# Altium project PCB_Project.PrjPcb
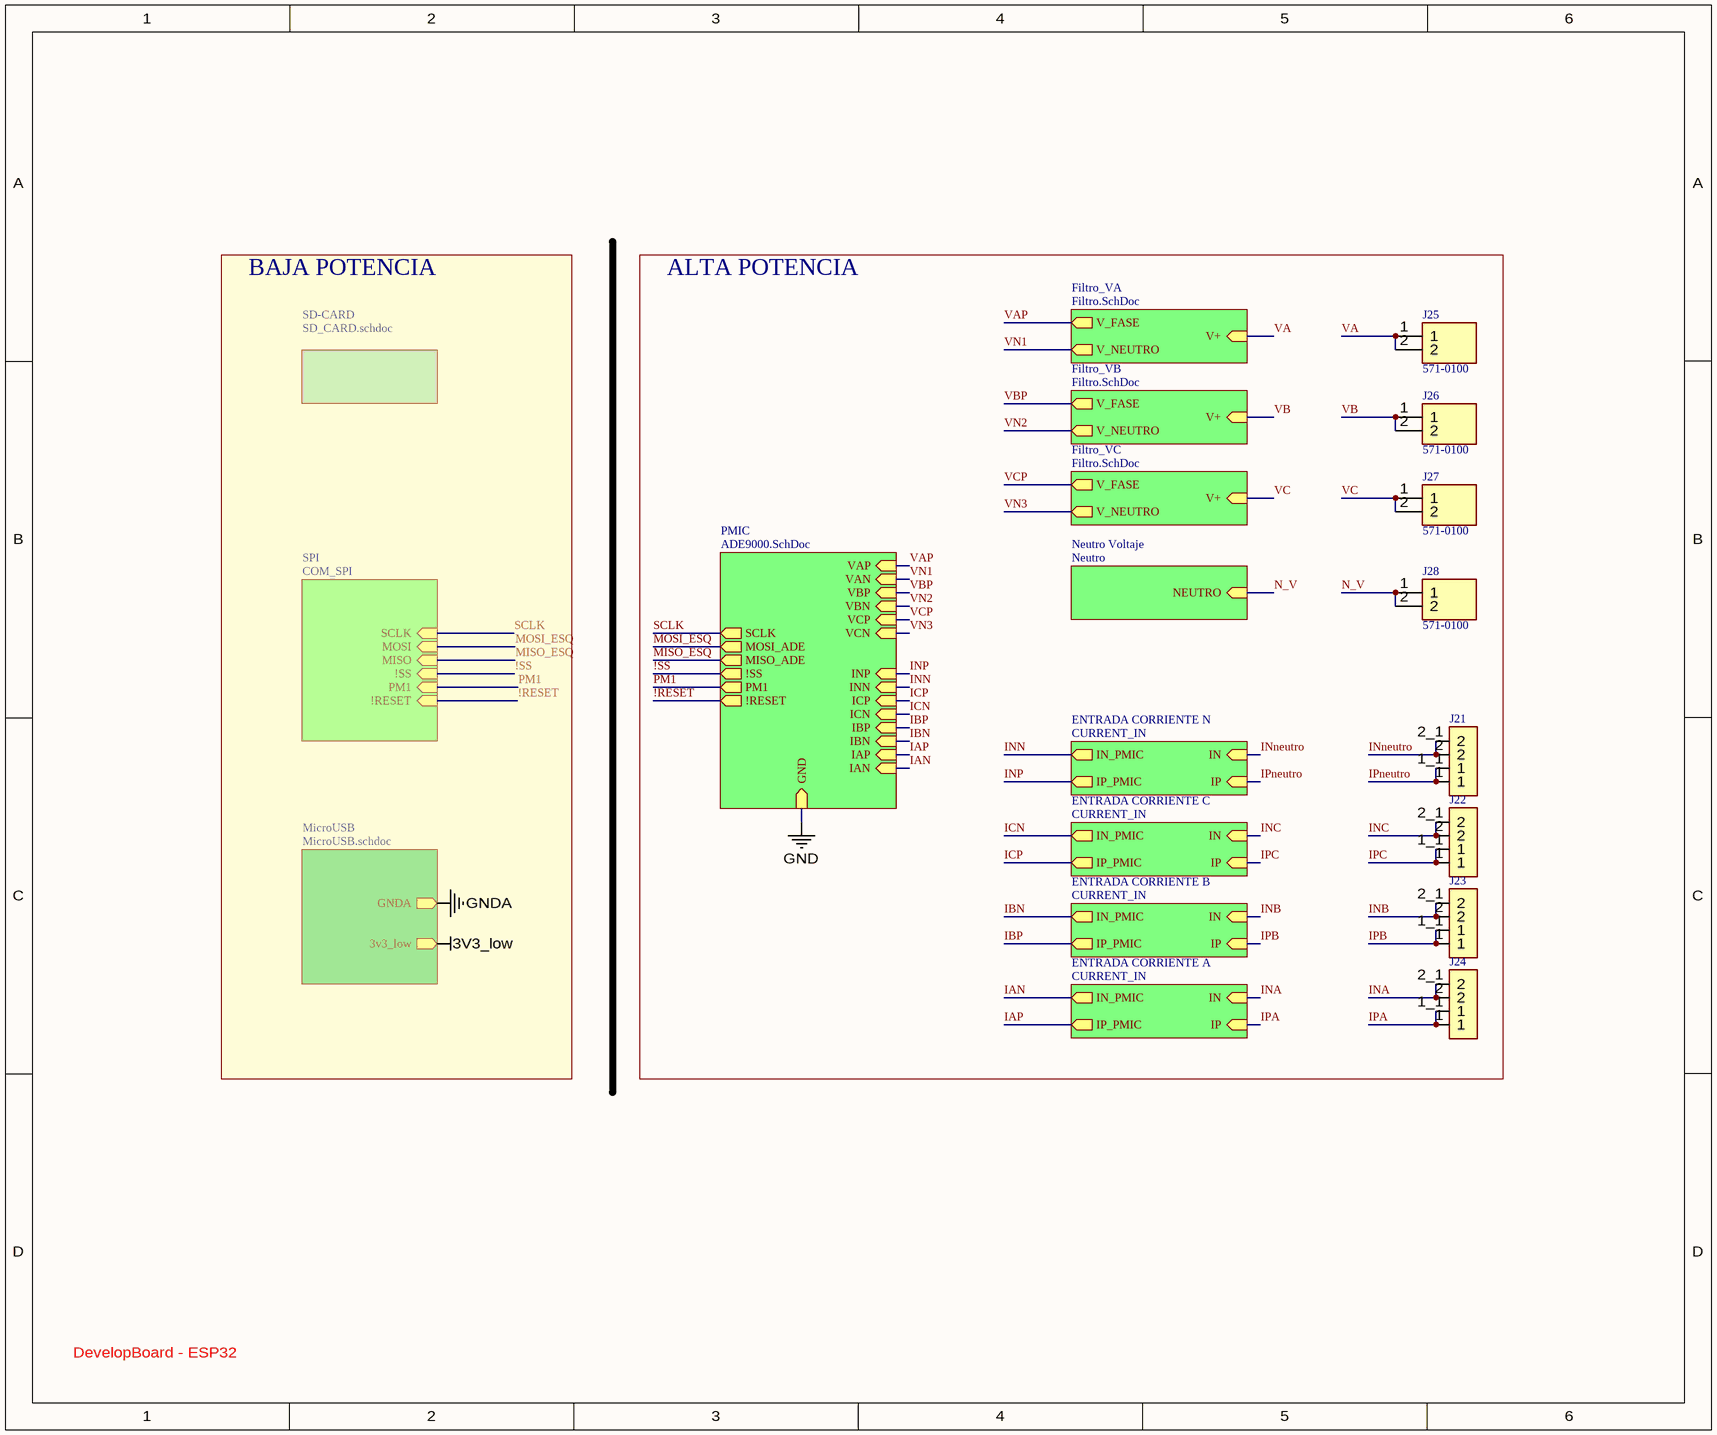
[diagram p0: Esquematico1.schdoc]
7 sheets, 124 parts. Net scope: hierarchical (ports join the sheet entries above them; power ports are global).
Board file: Esquematico.PcbDoc
Sheets:
  Esquematico1.schdoc
    MicroUSB = MicroUSB.SchDoc
    Filtro_VA = Filtro.SchDoc
    Filtro_VB = Filtro.SchDoc
    Filtro_VC = Filtro.SchDoc
    PMIC = ADE9000.SchDoc
    SPI = COM_SPI.SchDoc
    ENTRADA CORRIENTE N = CURRENT_IN.SchDoc
    ENTRADA CORRIENTE C = CURRENT_IN.SchDoc
    ENTRADA CORRIENTE B = CURRENT_IN.SchDoc
    ENTRADA CORRIENTE A = CURRENT_IN.SchDoc
    Neutro Voltaje = Neutro.SchDoc

## Sheet Esquematico1.schdoc
size 321 x 267 mm

### Parts
J21  2834082-1  [TE_2834082-1]  (value not drawn)
J22  2834082-1  [TE_2834082-1]  (value not drawn)
J23  2834082-1  [TE_2834082-1]  (value not drawn)
J24  2834082-1  [TE_2834082-1]  (value not drawn)
J25  571-0100  [5710100]
J26  571-0100  [5710100]
J27  571-0100  [5710100]
J28  571-0100  [5710100]

### Blocks framed on the sheet
ALTA POTENCIA: J21-J28

### Sub-sheets
ENTRADA CORRIENTE A = CURRENT_IN: IN (in), IP_PMIC (out), IP (in), IN_PMIC (out)
ENTRADA CORRIENTE B = CURRENT_IN: IN (in), IP_PMIC (out), IP (in), IN_PMIC (out)
ENTRADA CORRIENTE C = CURRENT_IN: IN (in), IP_PMIC (out), IP (in), IN_PMIC (out)
ENTRADA CORRIENTE N = CURRENT_IN: IN (in), IP_PMIC (out), IP (in), IN_PMIC (out)
Filtro_VA = Filtro.SchDoc: V+ (in), V_NEUTRO (out), V_FASE (out)
Filtro_VB = Filtro.SchDoc: V+ (in), V_NEUTRO (out), V_FASE (out)
Filtro_VC = Filtro.SchDoc: V+ (in), V_NEUTRO (out), V_FASE (out)
MicroUSB = MicroUSB.schdoc: GNDA (out), 3v3_low (out)
Neutro Voltaje = Neutro: NEUTRO (in)
PMIC = ADE9000.SchDoc: SCLK (out), PM1 (out), IBP (in), IBN (in), IAP (in), ICP (in), ICN (in), INP (in), INN (in), VAN (in), VAP (in), VBN (in), VBP (in), VCP (in), VCN (in), !RESET (out), !SS (out), IAN (in), GND (in), MISO_ADE (out), MOSI_ADE (out)
SD-CARD = SD_CARD.schdoc (file not in this document): no entries
SPI = COM_SPI: !RESET (in), PM1 (in), !SS (in), MISO (in), MOSI (in), SCLK (in)

### Nets
!RESET: sheet PMIC/!RESET, sheet SPI/!RESET
!SS: sheet PMIC/!SS, sheet SPI/!SS
IAN: sheet PMIC/IAN, sheet ENTRADA CORRIENTE A/IN_PMIC
IAP: sheet PMIC/IAP, sheet ENTRADA CORRIENTE A/IP_PMIC
IBN: sheet PMIC/IBN, sheet ENTRADA CORRIENTE B/IN_PMIC
IBP: sheet PMIC/IBP, sheet ENTRADA CORRIENTE B/IP_PMIC
ICN: sheet PMIC/ICN, sheet ENTRADA CORRIENTE C/IN_PMIC
ICP: sheet PMIC/ICP, sheet ENTRADA CORRIENTE C/IP_PMIC
INA: J24.2 J24.2_1(2) ; sheet ENTRADA CORRIENTE A/IN
INB: J23.2 J23.2_1(2) ; sheet ENTRADA CORRIENTE B/IN
INC: J22.2 J22.2_1(2) ; sheet ENTRADA CORRIENTE C/IN
INN: sheet PMIC/INN, sheet ENTRADA CORRIENTE N/IN_PMIC
INneutro: J21.2 J21.2_1(2) ; sheet ENTRADA CORRIENTE N/IN
INP: sheet PMIC/INP, sheet ENTRADA CORRIENTE N/IP_PMIC
IPA: J24.1 J24.1_1(1) ; sheet ENTRADA CORRIENTE A/IP
IPB: J23.1 J23.1_1(1) ; sheet ENTRADA CORRIENTE B/IP
IPC: J22.1 J22.1_1(1) ; sheet ENTRADA CORRIENTE C/IP
IPneutro: J21.1 J21.1_1(1) ; sheet ENTRADA CORRIENTE N/IP
MISO_ESQ: sheet PMIC/MISO_ADE, sheet SPI/MISO  [project net MISO_ADE9000]
MOSI_ESQ: sheet PMIC/MOSI_ADE, sheet SPI/MOSI  [project net MOSI_ADE9000]
N_V: J28.1 J28.2 ; sheet Neutro Voltaje/NEUTRO
PM1: sheet PMIC/PM1, sheet SPI/PM1
SCLK: sheet PMIC/SCLK, sheet SPI/SCLK
VA: J25.1 J25.2 ; sheet Filtro_VA/V+
VAP: sheet Filtro_VA/V_FASE, sheet PMIC/VAP
VB: J26.1 J26.2 ; sheet Filtro_VB/V+
VBP: sheet Filtro_VB/V_FASE, sheet PMIC/VBP
VC: J27.1 J27.2 ; sheet Filtro_VC/V+
VCP: sheet Filtro_VC/V_FASE, sheet PMIC/VCP
VN1: sheet Filtro_VA/V_NEUTRO, sheet PMIC/VAN
VN2: sheet Filtro_VB/V_NEUTRO, sheet PMIC/VBN
VN3: sheet Filtro_VC/V_NEUTRO, sheet PMIC/VCN

### Notes on the sheet
- BAJA POTENCIA
- DevelopBoard - ESP32

### Library data of the parts
J21-J24 = 2834082-1: Conn PC Terminal Block 2 POS 5mm Solder ST Thru-Hole 20A/Contact Box/Carton; MF: TE Connectivity; TE_purchase_URL: https://www.te.com/usa-en/product-2834082-1.html?te_bu=Cor&te_type=disp&te_campaign=seda_glo_cor-seda-global-disp-prtnr-fy19-seda-model-bom-cta_sma-317_1&elqCampaignId=32493; Digi-Key_Part_Number: A124223-ND; Package: None; SnapEDA_Link: https://www.snapeda.com/parts/2834082-1/TE%20Connectivity%20AMP%20Connectors/view-part/2471183/?ref=snap; MP: 2834082-1; Value: *; Digi-Key_Purchase_URL: https://www.digikey.com/product-detail/en/te-connectivity-amp-connectors/2834082-1/A124223-ND/6012670?utm_source=snapeda&utm_medium=aggregator&utm_campaign=symbol; Comment_1: *
J25-J28 = 571-0100: Connector; Manufacturer_Name: Deltron; Datasheet Link: https://www.dem-uk.com/deltron-components/Data/Product_Downloads/deltron-571-0100-4mm-90deg-single-socket-data.pdf; Height: 12.4mm; Manufacturer_Part_Number: 571-0100; Mouser Part Number: 164-6218; Mouser Price/Stock: https://www.mouser.co.uk/ProductDetail/Deltron/571-0100?qs=E2gf03EXmtoqC8%2FBhoPdrg%3D%3D

## Sheet MicroUSB.SchDoc
size A4
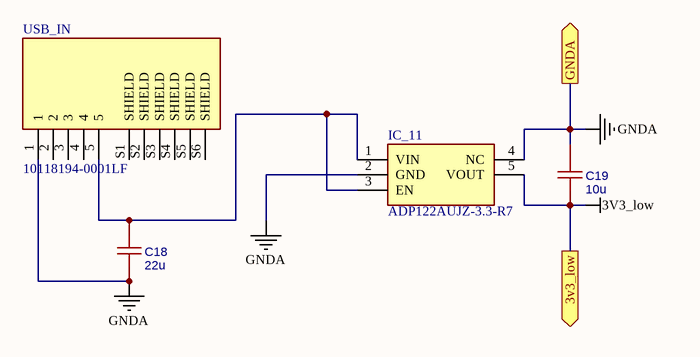
[diagram p1: MicroUSB.SchDoc]

### Parts
C18  22u  [CAPC3216X190]
C19  10u  [CAPC3216X190]
IC_11  ADP122AUJZ-3.3-R7  [SOT95P280X100-5N]
USB_IN  10118194-0001LF  [AMPHENOL_10118194-0001LF]

### Ports
3v3_low (out), GNDA (out)

### Nets
3V3_low: C19.1 IC_11.5(VOUT) ; port 3v3_low
GNDA: C18.1 C19.2 IC_11.2(GND) IC_11.4(NC) USB_IN.1 ; port GNDA
NetC18_2: C18.2 IC_11.1(VIN) IC_11.3(EN) USB_IN.5

Not connected (* = marked no-connect by the designer): USB_IN 2 3 4 S1(SHIELD) S2(SHIELD) S3(SHIELD) S4(SHIELD) S5(SHIELD) S6(SHIELD)

### Library data of the parts
C18 C19 = 100nF: nameAlias: Value(F); spicePre: C; spiceSymbolName: Cap_RAD-0.1_US
IC_11 = ADP122AUJZ-3.3-R7: Integrated Circuit; Manufacturer_Name: Analog Devices; Datasheet Link: http://uk.rs-online.com/web/p/products/9128071; Height: 1mm; Manufacturer_Part_Number: ADP122AUJZ-3.3-R7; Arrow Part Number: ADP122AUJZ-3.3-R7; Arrow Price/Stock: https://www.arrow.com/en/products/adp122aujz-3.3-r7/analog-devices; Mouser Part Number: 584-ADP122AUJZ-3.3R7; Mouser Price/Stock: https://www.mouser.co.uk/ProductDetail/Analog-Devices/ADP122AUJZ-33-R7?qs=BpaRKvA4VqERsawSFjb%252Blw%3D%3D
USB_IN = 10118194-0001LF: USB - micro B USB 2.0 Receptacle Connector 5 Position Surface Mount, Right Angle; Through Hole; MF: Amphenol ICC; Package: None; Price: None; Availability: Unavailable; MP: 10118194-0001LF; SnapEDA_Link: https://www.snapeda.com/parts/10118194-0001LF/Amphenol%20FCI/view-part/1413308/?ref=snap; Value: *

## Sheet Filtro.SchDoc
size A4
Used 3 times, as channels Filtro_VA, Filtro_VB, Filtro_VC. Parts and nets are listed once, with the designators drawn on the sheet.
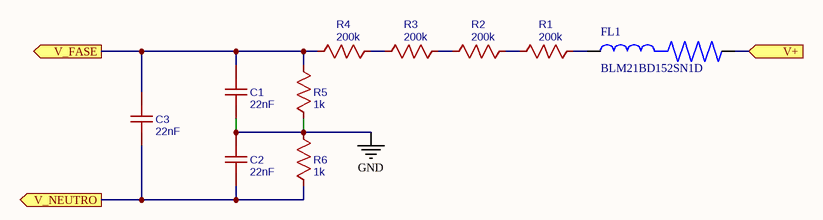
[diagram p2: Filtro.SchDoc]

### Parts
C1  22nF  [CAPC3216X190]
C2  22nF  [CAPC3216X190]
C3  22nF  [CAPC3216X190]
FL1  BLM21BD152SN1D  [BEADC2012X105N]
R1  200k  [RESC3216X75N]
R2  200k  [RESC3216X75N]
R3  200k  [RESC3216X75N]
R4  200k  [RESC3216X75N]
R5  1k  [RESC3216X75N]
R6  1k  [RESC3216X75N]

### Ports
V+ (in), V_FASE (out), V_NEUTRO (out)

### Nets
GND: C1.1 C2.2 R5.1 R6.2
V+: FL1.2 ; port V+
V_FASE: C1.2 C3.2 R4.1 R5.2 ; port V_FASE
V_NEUTRO: C2.1 C3.1 R6.1 ; port V_NEUTRO
NetFL1_1: FL1.1 R1.2
NetR1_1: R1.1 R2.2
NetR2_1: R2.1 R3.2
NetR3_1: R3.1 R4.2

### Channels
Filtro_VA: designators C1=C7 C2=C8 C3=C9 FL1=FL3 R1=R13 R2=R14 R3=R15 R4=R16 R5=R17 R6=R18; ports V+=VA V_FASE=VAP V_NEUTRO=VN1
Filtro_VB: designators C1=C4 C2=C5 C3=C6 FL1=FL2 R1=R7 R2=R8 R3=R9 R4=R10 R5=R11 R6=R12; ports V+=VB V_FASE=VBP V_NEUTRO=VN2
Filtro_VC: ports V+=VC V_FASE=VCP V_NEUTRO=VN3

### Library data of the parts
C1-C3 = 22nF: nameAlias: Value(F); spicePre: C; spiceSymbolName: Cap_RAD-0.1_US
FL1 = BLM21BD152SN1D: 1.5 kOhms @ 100MHz 1 Signal Line Ferrite Bead 0805 (2012 Metric) 250mA 450mOhm; MF: Murata; Availability: Good; Check_prices: https://www.snapeda.com/parts/BLM21BD152SN1D/Murata/view-part/290529/?ref=eda; Value: *; Package: 2012 Murata; MP: BLM21BD152SN1D; Price: None; SnapEDA_Link: https://www.snapeda.com/parts/BLM21BD152SN1D/Murata/view-part/290529/?ref=snap; Purchase-URL: https://pricing.snapeda.com/search/part/BLM21BD152SN1D/?ref=eda
R1-R4 = 330k: nameAlias: Value(Ω); spicePre: R; spiceSymbolName: Res_AXIAL-0.3(1/8W)_US
R5 R6 = 1k: nameAlias: Value(Ω); spicePre: R; spiceSymbolName: Res_AXIAL-0.3(1/8W)_US

## Sheet ADE9000.SchDoc
size A4
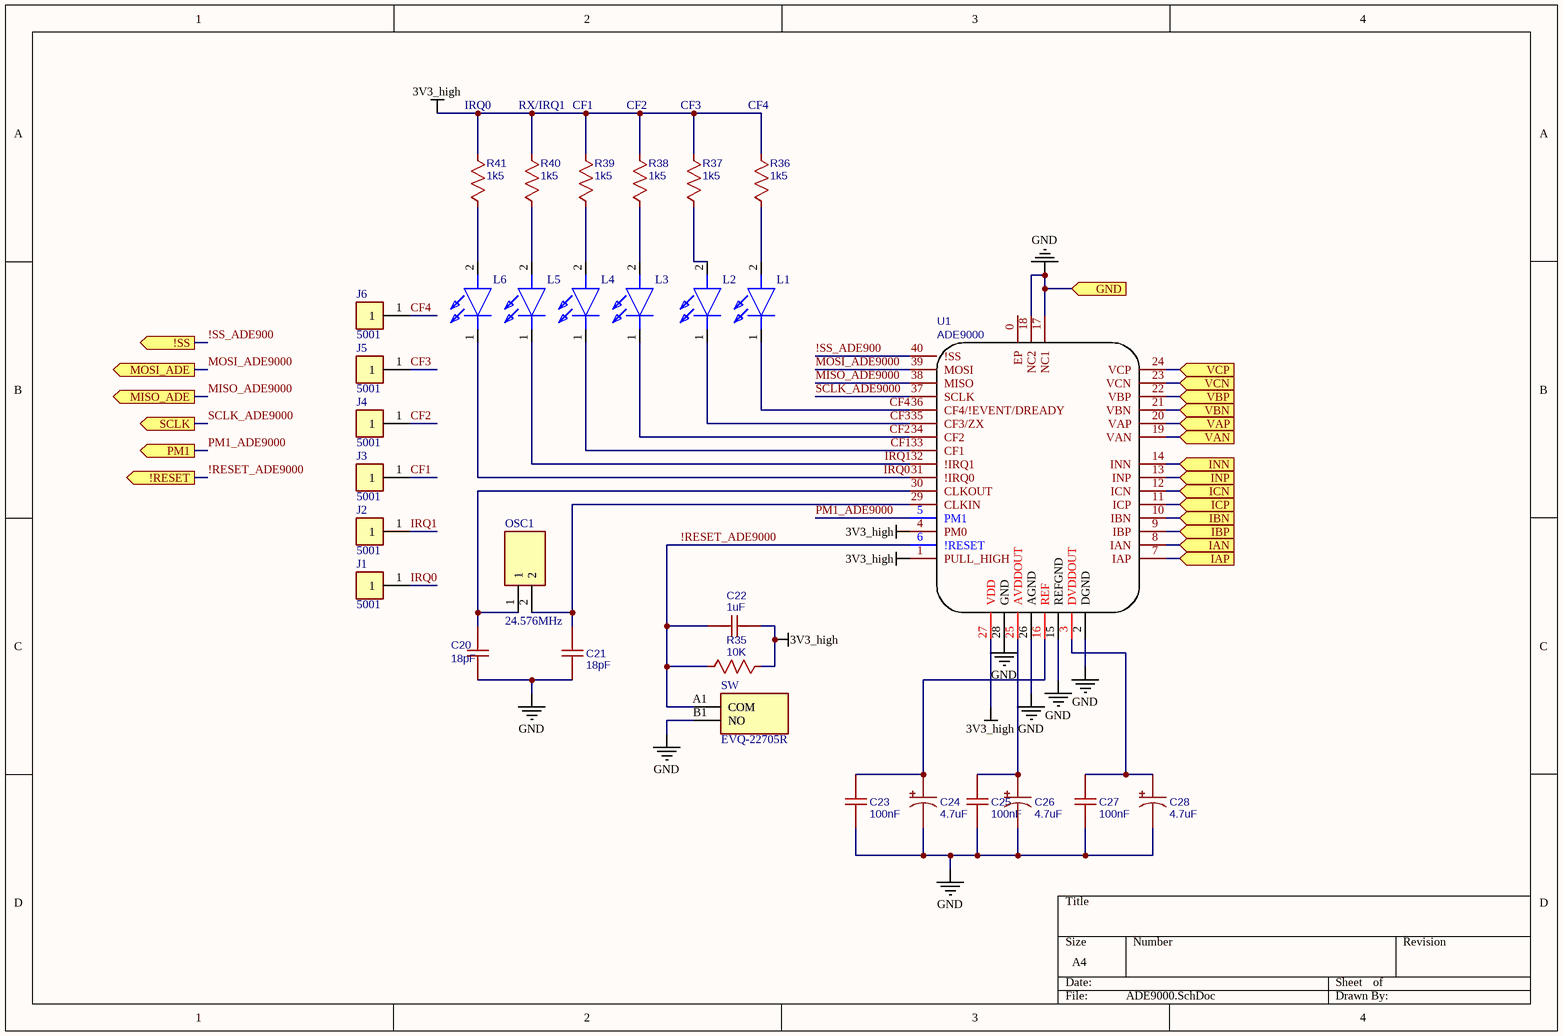
[diagram p3: ADE9000.SchDoc]

### Parts
C20  18pF  [CAPC3216X190]
C21  18pF  [CAPC3216X190]
C22  1uF  [CAPC3216X190]
C23  100nF  [CAPC3216X190]
C24  4.7uF  [CAPC3216X190]
C25  100nF  [CAPC3216X190]
C26  4.7uF  [CAPC3216X190]
C27  100nF  [CAPC3216X190]
C28  4.7uF  [CAPC3216X190]
J1  5001  [KEYSTONE_5001]
J2  5001  [KEYSTONE_5001]
J3  5001  [KEYSTONE_5001]
J4  5001  [KEYSTONE_5001]
J5  5001  [KEYSTONE_5001]
J6  5001  [KEYSTONE_5001]
L1  APT1608LZGCK  [LEDC1608X85N]  (value not drawn)
L2  APT1608LZGCK  [LEDC1608X85N]  (value not drawn)
L3  APT1608LZGCK  [LEDC1608X85N]  (value not drawn)
L4  APT1608LZGCK  [LEDC1608X85N]  (value not drawn)
L5  APT1608LZGCK  [LEDC1608X85N]  (value not drawn)
L6  APT1608LZGCK  [LEDC1608X85N]  (value not drawn)
OSC1  24.576MHz  [HC-49S_1]
R35  10K  [RESC3216X75N]
R36  1k5  [RESC3216X75N]
R37  1k5  [RESC3216X75N]
R38  1k5  [RESC3216X75N]
R39  1k5  [RESC3216X75N]
R40  1k5  [RESC3216X75N]
R41  1k5  [RESC3216X75N]
SW  EVQ-22705R  [EVQ22705R]
U1  ADE9000  [QFN50P600X600X80-41N]

### Ports
!RESET (out), !SS (out), GND (in), IAN (in), IAP (in), IBN (in), IBP (in), ICN (in), ICP (in), INN (in), INP (in), MISO_ADE (out), MOSI_ADE (out), PM1 (out), SCLK (out), VAN (in), VAP (in), VBN (in), VBP (in), VCN (in), VCP (in)

### Nets
3V3_high: C22.1 R35.2 R36.2 R37.2 R38.2 R39.2 R40.2 R41.2 U1.1(PULL_HIGH) U1.4(PM0) U1.27(VDD)
GND: C20.1 C21.1 C23.1 C24.2 C25.1 C26.2 C27.1 C28.2 SW.B1(NO) U1.2(DGND) U1.15(REFGND) U1.17(NC1) U1.18(NC2) U1.26(AGND) U1.28(GND) ; port GND
!RESET_ADE9000: C22.2 R35.1 SW.A1(COM) U1.6(!RESET) ; port !RESET  [project net !RESET]
!SS_ADE900: U1.40(!SS) ; port !SS  [project net !SS]
CF1: J3.1 L4.1(K) U1.33(CF1)
CF2: J4.1 L3.1(K) U1.34(CF2)
CF3: J5.1 L2.1(K) U1.35(CF3/ZX)
CF4: J6.1 L1.1(K) U1.36(CF4/!EVENT/DREADY)
IAN: U1.8(IAN) ; port IAN
IAP: U1.7(IAP) ; port IAP
IBN: U1.10(IBN) ; port IBN
IBP: U1.9(IBP) ; port IBP
ICN: U1.12(ICN) ; port ICN
ICP: U1.11(ICP) ; port ICP
INN: U1.14(INN) ; port INN
INP: U1.13(INP) ; port INP
IRQ0: J1.1 L6.1(K) U1.31(!IRQ0)
IRQ1: J2.1 L5.1(K) U1.32(!IRQ1)
MISO_ADE9000: U1.38(MISO) ; port MISO_ADE
MOSI_ADE9000: U1.39(MOSI) ; port MOSI_ADE
PM1_ADE9000: U1.5(PM1) ; port PM1  [project net PM1]
SCLK_ADE9000: U1.37(SCLK) ; port SCLK  [project net SCLK]
VAP: U1.20(VAP) ; port VAP
VBP: U1.22(VBP) ; port VBP
VCP: U1.24(VCP) ; port VCP
VN1: U1.19(VAN) ; port VAN
VN2: U1.21(VBN) ; port VBN
VN3: U1.23(VCN) ; port VCN
NetC20_2: C20.2 OSC1.1 U1.30(CLKOUT)
NetC21_2: C21.2 OSC1.2 U1.29(CLKIN)
NetC23_2: C23.2 C24.1 U1.16(REF)
NetC25_2: C25.2 C26.1 U1.25(AVDDOUT)
NetC27_2: C27.2 C28.1 U1.3(DVDDOUT)
NetL1_2: L1.2(A) R36.1
NetL2_2: L2.2(A) R37.1
NetL3_2: L3.2(A) R38.1
NetL4_2: L4.2(A) R39.1
NetL5_2: L5.2(A) R40.1
NetL6_2: L6.2(A) R41.1

Not connected (* = marked no-connect by the designer): U1 0(EP)

### Notes on the sheet
- IRQ0
- RX/IRQ1
- CF1
- CF2
- CF3
- CF4

### Library data of the parts
C20 C21 = 16pF: nameAlias: Value(F); spicePre: C; spiceSymbolName: Cap_RAD-0.1_US
C22 = 1uF: nameAlias: Value(F); spicePre: C; spiceSymbolName: Cap_RAD-0.1_US
C23 C25 C27 = 100nF: nameAlias: Value(F); spicePre: C; spiceSymbolName: Cap_RAD-0.1_US
C24 C26 C28 = 4.7uF: nameAlias: Value(F); spicePre: C; spiceSymbolName: Cap_Electrolytic(TH)_D5.0XF2.0_US
J1-J6 = 5001: Conn Test Point SKT 1 POS ST Thru-Hole 1 Port; MF: Keystone Electronics Corp.; SnapEDA_Link: https://www.snapeda.com/parts/5001/Keystone%20Electronics/view-part/4775115/?ref=snap; Purchase-URL: https://pricing.snapeda.com/search/part/5001/?ref=eda; Value: *; Availability: Good; MP: 5001; Price: None; Package: None; Check_prices: https://www.snapeda.com/parts/5001/Keystone%20Electronics/view-part/4775115/?ref=eda
L1-L6 = APT1608LZGCK: LED; Manufacturer_Name: Kingbright; Datasheet Link: https://www.mouser.com/datasheet/2/216/APT1608LZGCK-535830.pdf; Height: 0.85mm; Manufacturer_Part_Number: APT1608LZGCK; Arrow Part Number: APT1608LZGCK; Arrow Price/Stock: https://www.arrow.com/en/products/apt1608lzgck/kingbright; Mouser Part Number: 604-APT1608LZGCK; Mouser Price/Stock: https://www.mouser.co.uk/ProductDetail/Kingbright/APT1608LZGCK?qs=6oMev5NRZMFGFINT%2FafRYg%3D%3D
OSC1 = 9B16000381: Crystal or Oscillator; Manufacturer_Name: TXC; Datasheet Link: http://www.txccorp.com/download/products/quartz_crystals/2015TXC_9B_33.pdf; Manufacturer_Part_Number: 9B16000381; Arrow Part Number: 9B16000381
R35-R41 = 10K: nameAlias: Value(Ω); spicePre: R; spiceSymbolName: Res_AXIAL-0.3(1/8W)_US
SW = EVQ-22705R: Switch; Manufacturer_Name: Panasonic; Datasheet Link: https://www.mouser.com/datasheet/2/315/sw_lt_eng_5n_2r-1099494.pdf; Height: 5mm; Manufacturer_Part_Number: EVQ-22705R; Arrow Part Number: EVQ-22705R; Arrow Price/Stock: https://www.arrow.com/en/products/evq-22705r/panasonic; Mouser Part Number: 667-EVQ-22705R; Mouser Price/Stock: https://www.mouser.co.uk/ProductDetail/Panasonic/EVQ-22705R?qs=WwqriLBepZv9VD2fPMeXiQ%3D%3D
U1 = ADE9000: BOM_Manufacturer: Analog Devices; BOM_Manufacturer Part: ADE9000ACPZ-RL; BOM_Supplier Part: ADE9000ACPZ-RLCT-ND; BOM_Supplier: Digi-Key; spicePre: U

## Sheet COM_SPI.SchDoc
size A4
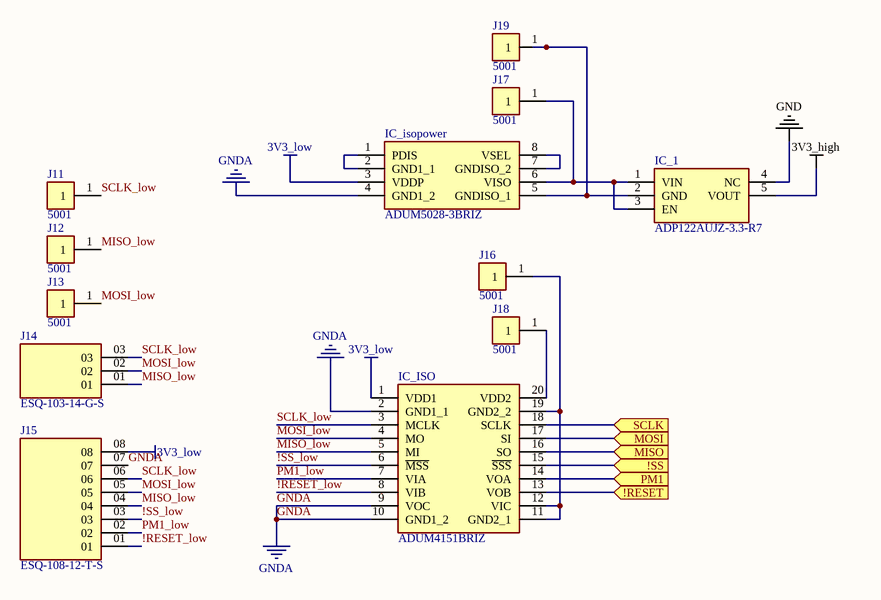
[diagram p4: COM_SPI.SchDoc]

### Parts
IC_1  ADP122AUJZ-3.3-R7  [SOT95P280X100-5N]
IC_ISO  ADUM4151BRIZ  [SOIC127P1031X264-20N]
IC_isopower  ADUM5028-3BRIZ  [SOIC127P1031X265-8N]
J11  5001  [KEYSTONE_5001]
J12  5001  [KEYSTONE_5001]
J13  5001  [KEYSTONE_5001]
J14  ESQ-103-14-G-S  [SAMTEC_ESQ-103-14-G-S]
J15  ESQ-108-12-T-S  [SAMTEC_ESQ-108-12-T-S]
J16  5001  [KEYSTONE_5001]
J17  5001  [KEYSTONE_5001]
J18  5001  [KEYSTONE_5001]
J19  5001  [KEYSTONE_5001]

### Ports
!RESET (in), !SS (in), MISO (in), MOSI (in), PM1 (in), SCLK (in)

### Nets
3V3_high: IC_1.5(VOUT)
3V3_low: IC_ISO.1(VDD1) IC_isopower.3(VDDP) J15.08
GND: IC_1.4(NC)
GNDA: IC_ISO.2(GND1_1) IC_ISO.9(VOC) IC_ISO.10(GND1_2) IC_isopower.4(GND1_2) J15.07
!RESET: IC_ISO.13(VOB) ; port !RESET
!RESET_low: IC_ISO.8(VIB) J15.01
!SS: IC_ISO.15(~{SSS}) ; port !SS
!SS_low: IC_ISO.6(~{MSS}) J15.03
MISO_ADE9000: IC_ISO.16(SO) ; port MISO
MISO_low: IC_ISO.5(MI) J12.1 J14.01 J15.04
MOSI_ADE9000: IC_ISO.17(SI) ; port MOSI
MOSI_low: IC_ISO.4(MO) J13.1 J14.02 J15.05
PM1: IC_ISO.14(VOA) ; port PM1
PM1_low: IC_ISO.7(VIA) J15.02
SCLK: IC_ISO.18(SCLK) ; port SCLK
SCLK_low: IC_ISO.3(MCLK) J11.1 J14.03 J15.06
NetIC_1_1: IC_1.1(VIN) IC_1.3(EN) IC_isopower.6(VISO) J17.1
NetIC_1_2: IC_1.2(GND) IC_isopower.5(GNDISO_1) J19.1
NetIC_ISO_11: IC_ISO.11(GND2_1) IC_ISO.12(VIC) IC_ISO.19(GND2_2) J16.1
NetIC_ISO_20: IC_ISO.20(VDD2) J18.1
NetIC_isopower_1: IC_isopower.1(PDIS) IC_isopower.2(GND1_1)
NetIC_isopower_7: IC_isopower.7(GNDISO_2) IC_isopower.8(VSEL)

### Library data of the parts
IC_1 = ADP122AUJZ-3.3-R7: as IC_11 on sheet MicroUSB; Datasheet Link: http://uk.rs-online.com/web/p/products/9128071; Height: 1mm; Manufacturer_Part_Number: ADP122AUJZ-3.3-R7; Arrow Part Number: ADP122AUJZ-3.3-R7; Arrow Price/Stock: https://www.arrow.com/en/products/adp122aujz-3.3-r7/analog-devices; Mouser Part Number: 584-ADP122AUJZ-3.3R7; Mouser Price/Stock: https://www.mouser.co.uk/ProductDetail/Analog-Devices/ADP122AUJZ-33-R7?qs=BpaRKvA4VqERsawSFjb%252Blw%3D%3D
IC_ISO = ADUM4151BRIZ: Integrated Circuit; Manufacturer_Name: Analog Devices; Datasheet Link: http://www.analog.com/media/en/technical-documentation/data-sheets/ADuM4151_4152_4153.pdf; Height: 2.64mm; Manufacturer_Part_Number: ADUM4151BRIZ; Arrow Part Number: ADUM4151BRIZ; Arrow Price/Stock: https://www.arrow.com/en/products/adum4151briz/analog-devices; Mouser Part Number: 584-ADUM4151BRIZ; Mouser Price/Stock: https://www.mouser.co.uk/ProductDetail/Analog-Devices/ADUM4151BRIZ?qs=iCT64eccu7hBfyU9ooJLRg%3D%3D
IC_isopower = ADUM5028-3BRIZ: Integrated Circuit; Manufacturer_Name: Linear Technology; Datasheet Link: https://componentsearchengine.com/Datasheets/1/ADUM5028-3BRIZ.pdf; Height: 2.65mm; Manufacturer_Part_Number: ADUM5028-3BRIZ; Mouser Part Number: 584-ADUM5028-3BRIZ; Mouser Price/Stock: https://www.mouser.com/Search/Refine.aspx?Keyword=584-ADUM5028-3BRIZ
J11-J13 J16-J19 = 5001: as J1 on sheet ADE9000; SnapEDA_Link: https://www.snapeda.com/parts/5001/Keystone%20Electronics/view-part/4775115/?ref=snap; Purchase-URL: https://pricing.snapeda.com/search/part/5001/?ref=eda; Value: *; Availability: Good; MP: 5001; Price: None; Package: None; Check_prices: https://www.snapeda.com/parts/5001/Keystone%20Electronics/view-part/4775115/?ref=eda
J14 = ESQ-103-14-G-S: Conn Elevated Socket SKT 3 POS 2.54mm Solder ST Top Entry Thru-Hole Bulk; MF: Samtec; SnapEDA_Link: https://www.snapeda.com/parts/ESQ-103-14-G-S/Samtec/view-part/3463809/?ref=snap; MP: ESQ-103-14-G-S; Availability: Bad; Price: None; Value: *; Package: None
J15 = ESQ-108-12-T-S: Conn Elevated Socket SKT 8 POS 2.54mm Solder ST Top Entry Thru-Hole Tube; MF: Samtec; MP: ESQ-108-12-T-S; Price: None; SnapEDA_Link: https://www.snapeda.com/parts/ESQ-108-12-T-S/Samtec/view-part/3520893/?ref=snap; Package: None; Toby_UK-Purchase-URL: https://snapeda.com/shop?store=Toby+UK&id=3520893; Value: *; Availability: Bad

## Sheet CURRENT_IN.SchDoc
size A4
Used 4 times, as channels ENTRADA CORRIENTE N, ENTRADA CORRIENTE C, ENTRADA CORRIENTE B, ENTRADA CORRIENTE A. Parts and nets are listed once, with the designators drawn on the sheet.
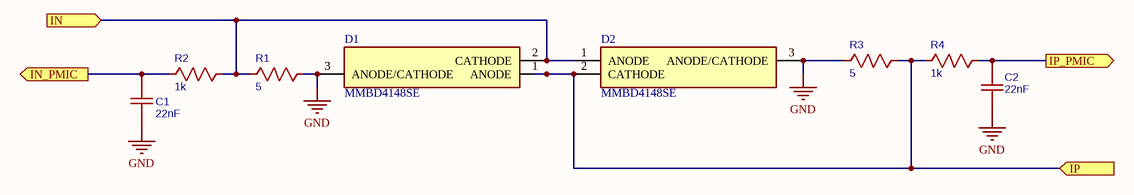
[diagram p5: CURRENT_IN.SchDoc]

### Parts
C1  22nF  [CAPC3216X190]
C2  22nF  [CAPC3216X190]
D1  MMBD4148SE  [SOT95P240X120-3N]
D2  MMBD4148SE  [SOT95P240X120-3N]
R1  5  [RESC3216X75N]
R2  1k  [RESC3216X75N]
R3  5  [RESC3216X75N]
R4  1k  [RESC3216X75N]

### Ports
IN (in), IN_PMIC (out), IP (in), IP_PMIC (out)

### Nets
GND: C1.1 C2.1 D1.3(ANODE/CATHODE) D2.3(ANODE/CATHODE) R1.2 R3.1
IN: D1.2(CATHODE) D2.1(ANODE) R1.1 R2.2 ; port IN
IN_PMIC: C1.2 R2.1 ; port IN_PMIC
IP: D1.1(ANODE) D2.2(CATHODE) R3.2 R4.1 ; port IP
IP_PMIC: C2.2 R4.2 ; port IP_PMIC

### Channels
ENTRADA CORRIENTE N: designators C1=C17 C2=C16 D1=D7 D2=D8 R1=R33 R2=R34 R3=R32 R4=R31; ports IN=INneutro IN_PMIC=INN IP=IPneutro IP_PMIC=INP
ENTRADA CORRIENTE C: designators C1=C15 C2=C14 D1=D5 D2=D6 R1=R29 R2=R30 R3=R28 R4=R27; ports IN=INC IN_PMIC=ICN IP=IPC IP_PMIC=ICP
ENTRADA CORRIENTE B: designators C1=C13 C2=C12 D1=D3 D2=D4 R1=R25 R2=R26 R3=R24 R4=R23; ports IN=INB IN_PMIC=IBN IP=IPB IP_PMIC=IBP
ENTRADA CORRIENTE A: designators C1=C11 C2=C10 D1=D1 D2=D2 R1=R21 R2=R22 R3=R20 R4=R19; ports IN=INA IN_PMIC=IAN IP=IPA IP_PMIC=IAP

### Library data of the parts
C1 C2 = 22nF: nameAlias: Value(F); spicePre: C; spiceSymbolName: Cap_RAD-0.1_US
D1 D2 = MMBD4148SE: Diode; Manufacturer_Name: ON Semiconductor; Datasheet Link: http://www.onsemi.com/pub/Collateral/MMBD4148SE-D.pdf; Height: 1.2mm; Manufacturer_Part_Number: MMBD4148SE; Arrow Part Number: MMBD4148SE; Arrow Price/Stock: https://www.arrow.com/en/products/mmbd4148se/on-semiconductor; Mouser Part Number: 512-MMBD4148SE; Mouser Price/Stock: https://www.mouser.co.uk/ProductDetail/ON-Semiconductor-Fairchild/MMBD4148SE?qs=E58pcOqB2RIih%2Fj%252BJ4dF7g%3D%3D
R1-R4 = 1k: nameAlias: Value(Ω); spicePre: R; spiceSymbolName: Res_AXIAL-0.3(1/8W)_US

## Sheet Neutro.SchDoc
size A4
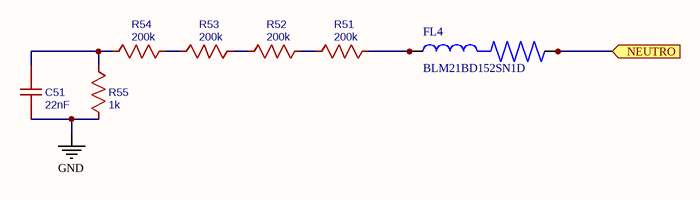
[diagram p6: Neutro.SchDoc]

### Parts
C51  22nF  [CAPC3216X190]
FL4  BLM21BD152SN1D  [BEADC2012X105N]
R51  200k  [RESC3216X75N]
R52  200k  [RESC3216X75N]
R53  200k  [RESC3216X75N]
R54  200k  [RESC3216X75N]
R55  1k  [RESC3216X75N]

### Ports
NEUTRO (in)

### Nets
GND: C51.1 R55.1
N_V: FL4.1 ; port NEUTRO
NetC51_2: C51.2 R54.1 R55.2
NetFL4_2: FL4.2 R51.2
NetR51_1: R51.1 R52.2
NetR52_1: R52.1 R53.2
NetR53_1: R53.1 R54.2

### Library data of the parts
C51 = 22nF: nameAlias: Value(F); spicePre: C; spiceSymbolName: Cap_RAD-0.1_US
FL4 = BLM21BD152SN1D: as FL1 on sheet Filtro; Availability: Good; Check_prices: https://www.snapeda.com/parts/BLM21BD152SN1D/Murata/view-part/290529/?ref=eda; Value: *; Package: 2012 Murata; MP: BLM21BD152SN1D; Price: None; SnapEDA_Link: https://www.snapeda.com/parts/BLM21BD152SN1D/Murata/view-part/290529/?ref=snap; Purchase-URL: https://pricing.snapeda.com/search/part/BLM21BD152SN1D/?ref=eda
R51-R54 = 330k: nameAlias: Value(Ω); spicePre: R; spiceSymbolName: Res_AXIAL-0.3(1/8W)_US
R55 = 1k: nameAlias: Value(Ω); spicePre: R; spiceSymbolName: Res_AXIAL-0.3(1/8W)_US

## Nets that join several sheets
3V3_high: ADE9000 (11 pins), COM_SPI (IC_1.5)
3V3_low: MicroUSB (C19.1 IC_11.5), COM_SPI (IC_ISO.1 IC_isopower.3 J15.08)
GND: Filtro_VA (C7.1 C8.2 R17.1 R18.2), Filtro_VB (C4.1 C5.2 R11.1 R12.2), Filtro_VC (C1.1 C2.2 R5.1 R6.2), ADE9000 (15 pins), COM_SPI (IC_1.4), ENTRADA CORRIENTE N (6 pins), ENTRADA CORRIENTE C (6 pins), ENTRADA CORRIENTE B (6 pins), ENTRADA CORRIENTE A (6 pins), Neutro (C51.1 R55.1)
GNDA: MicroUSB (5 pins), COM_SPI (5 pins)
!RESET: ADE9000 (C22.2 R35.1 SW.A1 U1.6), COM_SPI (IC_ISO.13)
!SS: ADE9000 (U1.40), COM_SPI (IC_ISO.15)
IAN: ADE9000 (U1.8), ENTRADA CORRIENTE A (C11.2 R22.1)
IAP: ADE9000 (U1.7), ENTRADA CORRIENTE A (C10.2 R19.2)
IBN: ADE9000 (U1.10), ENTRADA CORRIENTE B (C13.2 R26.1)
IBP: ADE9000 (U1.9), ENTRADA CORRIENTE B (C12.2 R23.2)
ICN: ADE9000 (U1.12), ENTRADA CORRIENTE C (C15.2 R30.1)
ICP: ADE9000 (U1.11), ENTRADA CORRIENTE C (C14.2 R27.2)
INA: Esquematico1 (J24.2 J24.2_1), ENTRADA CORRIENTE A (D1.2 D2.1 R21.1 R22.2)
INB: Esquematico1 (J23.2 J23.2_1), ENTRADA CORRIENTE B (D3.2 D4.1 R25.1 R26.2)
INC: Esquematico1 (J22.2 J22.2_1), ENTRADA CORRIENTE C (D5.2 D6.1 R29.1 R30.2)
INN: ADE9000 (U1.14), ENTRADA CORRIENTE N (C17.2 R34.1)
INneutro: Esquematico1 (J21.2 J21.2_1), ENTRADA CORRIENTE N (D7.2 D8.1 R33.1 R34.2)
INP: ADE9000 (U1.13), ENTRADA CORRIENTE N (C16.2 R31.2)
IPA: Esquematico1 (J24.1 J24.1_1), ENTRADA CORRIENTE A (D1.1 D2.2 R19.1 R20.2)
IPB: Esquematico1 (J23.1 J23.1_1), ENTRADA CORRIENTE B (D3.1 D4.2 R23.1 R24.2)
IPC: Esquematico1 (J22.1 J22.1_1), ENTRADA CORRIENTE C (D5.1 D6.2 R27.1 R28.2)
IPneutro: Esquematico1 (J21.1 J21.1_1), ENTRADA CORRIENTE N (D7.1 D8.2 R31.1 R32.2)
MISO_ADE9000: ADE9000 (U1.38), COM_SPI (IC_ISO.16)
MOSI_ADE9000: ADE9000 (U1.39), COM_SPI (IC_ISO.17)
N_V: Esquematico1 (J28.1 J28.2), Neutro (FL4.1)
PM1: ADE9000 (U1.5), COM_SPI (IC_ISO.14)
SCLK: ADE9000 (U1.37), COM_SPI (IC_ISO.18)
VA: Esquematico1 (J25.1 J25.2), Filtro_VA (FL3.2)
VAP: Filtro_VA (C7.2 C9.2 R16.1 R17.2), ADE9000 (U1.20)
VB: Esquematico1 (J26.1 J26.2), Filtro_VB (FL2.2)
VBP: Filtro_VB (C4.2 C6.2 R10.1 R11.2), ADE9000 (U1.22)
VC: Esquematico1 (J27.1 J27.2), Filtro_VC (FL1.2)
VCP: Filtro_VC (C1.2 C3.2 R4.1 R5.2), ADE9000 (U1.24)
VN1: Filtro_VA (C8.1 C9.1 R18.1), ADE9000 (U1.19)
VN2: Filtro_VB (C5.1 C6.1 R12.1), ADE9000 (U1.21)
VN3: Filtro_VC (C2.1 C3.1 R6.1), ADE9000 (U1.23)